# EAGLE schematic Powalowski_sch (EAGLE 7.7.0)
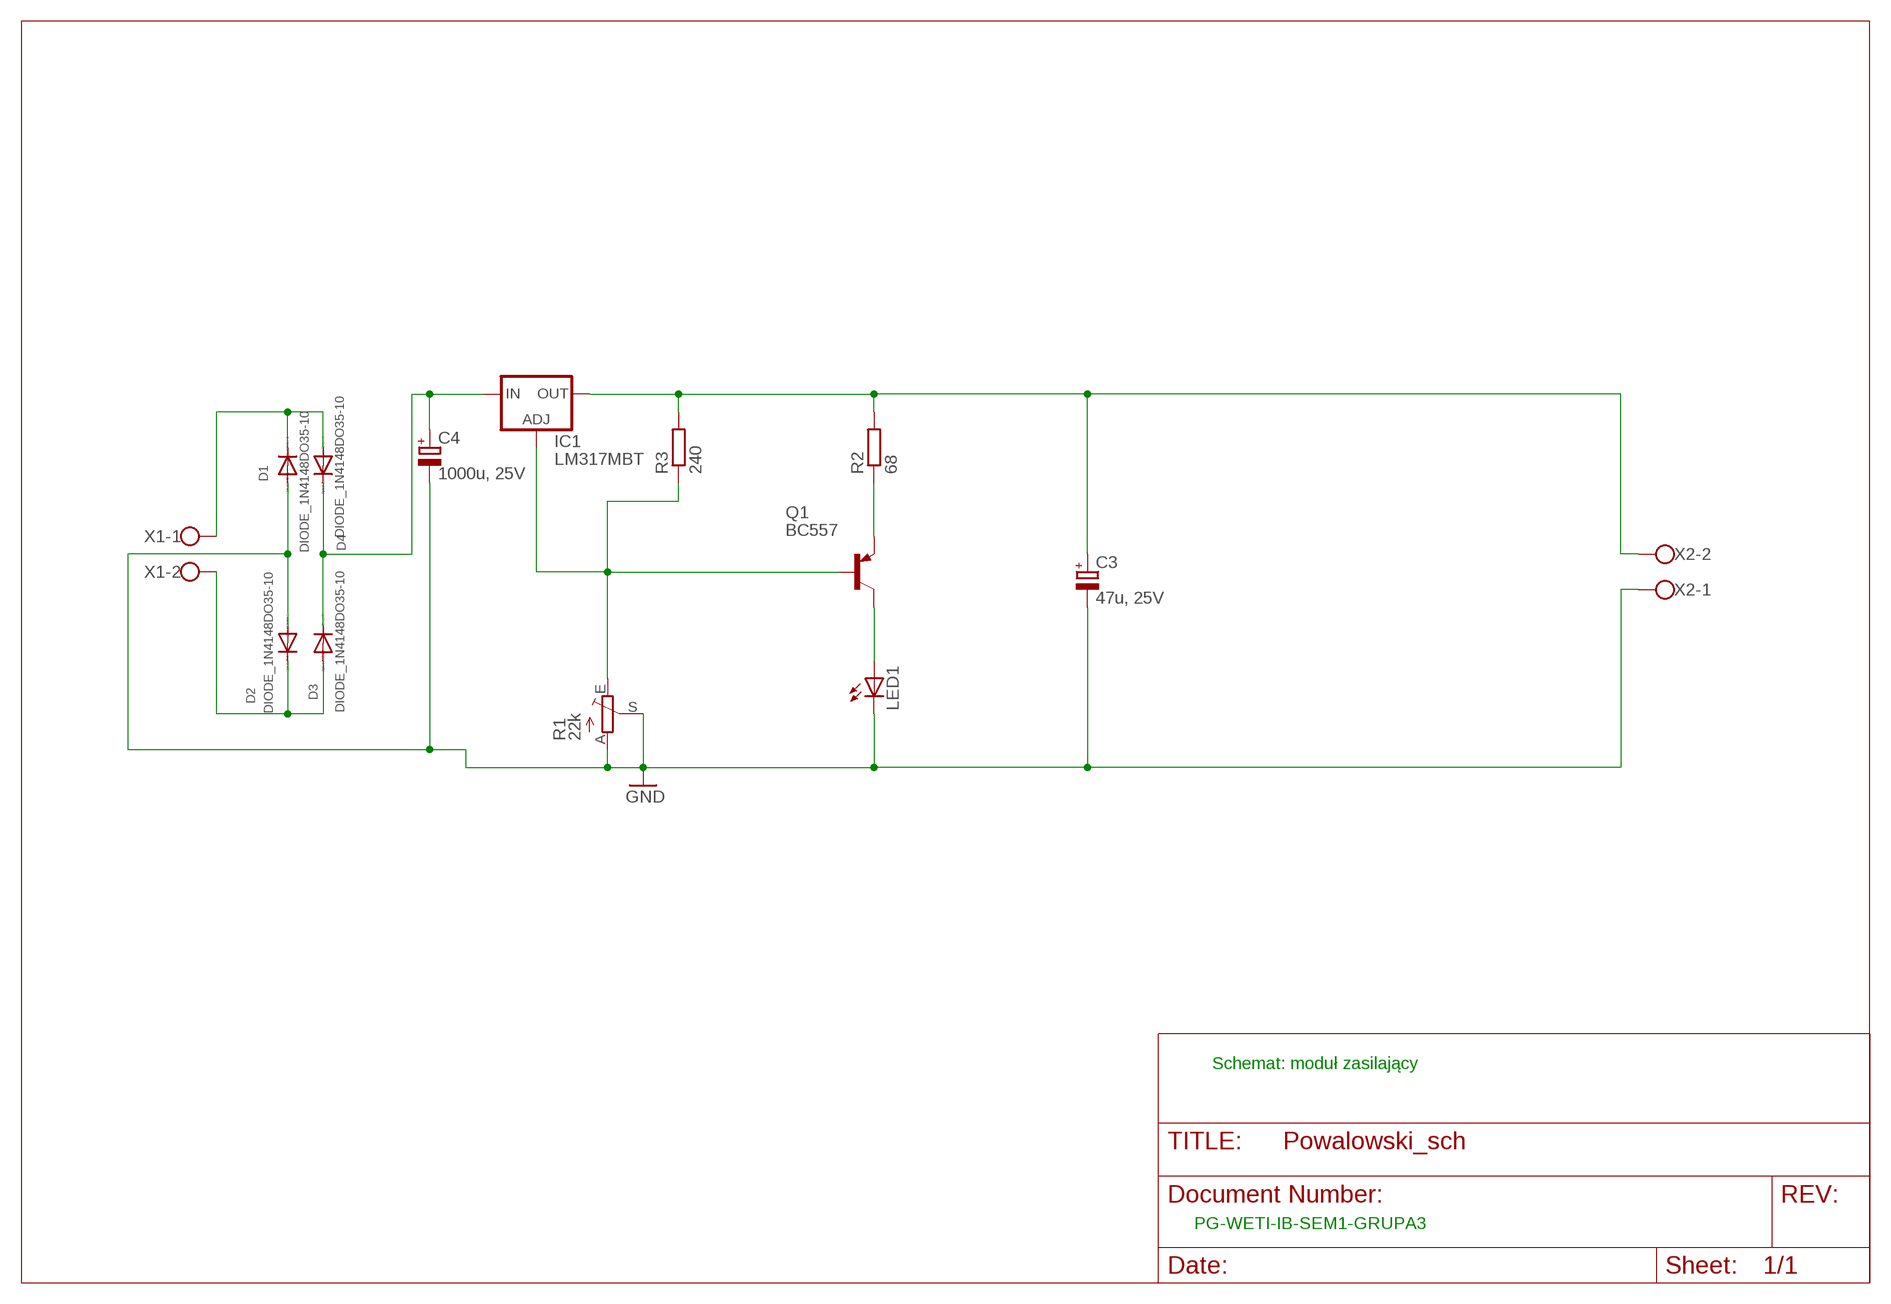
[diagram p0: schematic, sheet 1]

## Parts
C3  47u, 25V  CPOL-EUE7.5-16  [E7,5-16]
C4  1000u, 25V  CPOL-EUE7.5-16  [E7,5-16]
D1  DIODE_1N4148DO35-10  [DIODE_DO35-10]
D2  DIODE_1N4148DO35-10  [DIODE_DO35-10]
D3  DIODE_1N4148DO35-10  [DIODE_DO35-10]
D4  DIODE_1N4148DO35-10  [DIODE_DO35-10]
IC1  LM317MBT  [TO220L1]
LED1  LED_LED5MM  [LED_LED5MM]
Q1  BC557  [TO92-EBC]
R1  22k  TRIM_EU-RS3  [RS3]
R2  68  R-EU_R1210  [R1210]
R3  240  R-EU_R1210  [R1210]
X1  W237-102  [W237-102]
X2  W237-102  [W237-102]

## Nets
GND: C3.- C4.- D1.A D2.A LED1.K(C) R1.A R1.S X2.1
N$1: D1.C D4.A X1.1
N$3: LED1.A Q1.C
N$4: C4.+ D3.C D4.C IC1.3(IN)
N$5: D2.C D3.A X1.2
N$7: C3.+ IC1.2(OUT) R2.2 R3.2 X2.2
N$8: IC1.1(ADJ) Q1.B R1.E R3.1
N$10: Q1.E R2.1

## Notes on the sheet
- Schemat: moduł zasilający
- PG-WETI-IB-SEM1-GRUPA3

## Library data of the parts
C3 C4 = rcl:CPOL-EU: POLARIZED CAPACITOR, European symbol
D1-D4 = bbbbb:DIODE_1N4148: DIODE high speed (Philips)
IC1 = v-reg:LM317?*: 500 mA Adjustable Output Positive Voltage Regulator Source: http://www.onsemi.co.jp .. LM317M-D.PDF
LED1 = aaaaa:LED_LED: LED OSRAM: - CHIPLED LG R971, LG N971, LY N971, LG Q971, LY Q971, LO R971, LY R971 LH N974, LH R974 LS Q976, LO Q976, LY Q976 LO Q996 - Hyper CHIPLED LW Q18S LB Q993, LB Q99A, LB R99A - SideLED LS A670, LO A670, LY A670, LG A670, LP A670 LB A673, LV A673, LT A673, LW A673 LH A674 LY A675 LS A676, LA A676, LO A676, LY A676, LW A676 LS A679, LY A679, LG A679 - Hyper Micro SIDELED® LS Y876, LA Y876, LO Y876, LY Y876 LT Y87S - SmartLED LW L88C, LW L88S LB L89C, LB L89S, LG L890 LS L89K, LO L89K, LY L89K LS L896, LA L896, LO L896, LY L896 - TOPLED LS T670, LO T670, LY T670, LG T670, LP T670 LSG T670, LSP T670, LSY T670, LOP T670, LYG T670 LG T671, LOG T671, LSG T671 LB T673, LV T673, LT T673, LW T673 LH T674 LS T676, LA T676, LO T676, LY T676, LB T676, LH T676, LSB T676, LW T676 LB T67C, LV T67C, LT T67C, LS T67K, LO T67K, LY T67K, LW E67C LS E67B, LA E67B, LO E67B, LY E67B, LB E67C, LV E67C, LT E67C LW T67C LS T679, LY T679, LG T679 LS T770, LO T770, LY T770, LG T770, LP T770 LB T773, LV T773, LT T773, LW T773 LH T774 LS E675, LA E675, LY E675, LS T675 LS T776, LA T776, LO T776, LY T776, LB T776 LHGB T686 LT T68C, LB T68C - Hyper Mini TOPLED® LB M676 - Mini TOPLED Santana® LG M470 LS M47K, LO M47K, LY M47K Source: http://www.osram.convergy.de LUXEON: - LUMILED® LXK2-PW12-R00, LXK2-PW12-S00, LXK2-PW14-U00, LXK2-PW14-V00 LXK2-PM12-R00, LXK2-PM12-S00, LXK2-PM14-U00 LXK2-PE12-Q00, LXK2-PE12-R00, LXK2-PE12-S00, LXK2-PE14-T00, LXK2-PE14-U00 LXK2-PB12-K00, LXK2-PB12-L00, LXK2-PB12-M00, LXK2-PB14-N00, LXK2-PB14-P00, LXK2-PB14-Q00 LXK2-PR12-L00, LXK2-PR12-M00, LXK2-PR14-Q00, LXK2-PR14-R00 LXK2-PD12-Q00, LXK2-PD12-R00, LXK2-PD12-S00 LXK2-PH12-R00, LXK2-PH12-S00 LXK2-PL12-P00, LXK2-PL12-Q00, LXK2-PL12-R00 Source: www.luxeon.com KINGBRIGHT: KA-3528ASYC Source: www.kingbright.com
Q1 = transistor-pnp:BC557*: PNP Transistror
R1 = pot:TRIM_EU-: POTENTIOMETER
R2 R3 = resistor:R-EU_: RESISTOR, European symbol
X1 X2 = con-wago-500:W237-102: WAGO SCREW CLAMP; MPN: 237-102; OC_FARNELL: unknown; OC_NEWARK: 70K9898